# Altium schematic sheet S7CAS-PLEIADES-CARTE-FILLE_P02_ALIMENTATION.SchDoc
size Tabloid; DocumentNumber: 2; SheetNumber: 2; SheetTotal: 5; Size: 11x17; Sheet_Name: ALIMENTATION
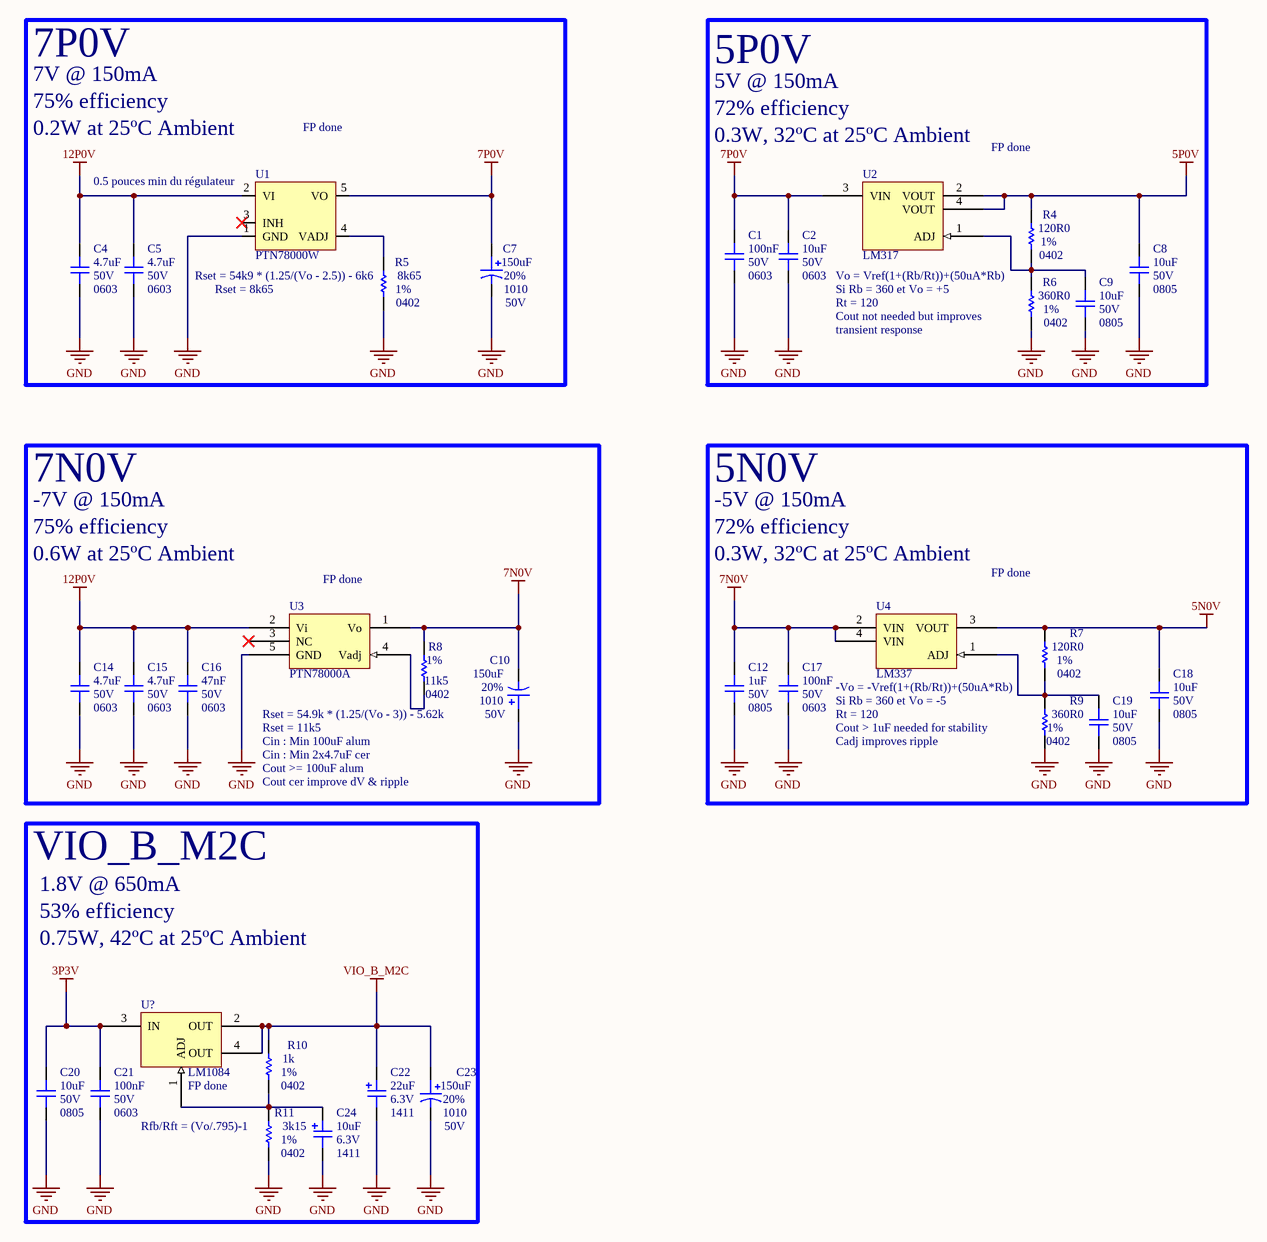
[diagram p0: S7CAS-PLEIADES-CARTE-FILLE_P02_ALIMENTATION.SchDoc]

## Parts
C1  value 100nF  Voltage: 50V  Package: 0603  [CAP_0603]  (hidden comment: CAP - 0603)
C2  value 10uF  Voltage: 50V  Package: 0603  [CAP_0603]  (hidden comment: CAP - 0603)
C4  value 4.7uF  Voltage: 50V  Package: 0603  [CAP_0603]  (hidden comment: CAP - 0603)
C5  value 4.7uF  Voltage: 50V  Package: 0603  [CAP_0603]  (hidden comment: CAP - 0603)
C7  value 150uF  Voltage: 50V  Package: 1010  Precision: 20%  [CAP_ALU_1010_vishay]  (hidden comment: MAL215099101E3)
C8  value 10uF  Voltage: 50V  Package: 0805  [CAP_0805]  (hidden comment: CAP - 0805)
C9  value 10uF  Voltage: 50V  Package: 0805  [CAP_0805]  (hidden comment: CAP - 0805)
C10  value 150uF  Voltage: 50V  Package: 1010  Precision: 20%  [CAP_ALU_1010_vishay]  (hidden comment: MAL215099101E3)
C12  value 1uF  Voltage: 50V  Package: 0805  [CAP_0805]  (hidden comment: CAP - 0805)
C14  value 4.7uF  Voltage: 50V  Package: 0603  [CAP_0603]  (hidden comment: CAP - 0603)
C15  value 4.7uF  Voltage: 50V  Package: 0603  [CAP_0603]  (hidden comment: CAP - 0603)
C16  value 47nF  Voltage: 50V  Package: 0603  [CAP_0603]  (hidden comment: CAP - 0603)
C17  value 100nF  Voltage: 50V  Package: 0603  [CAP_0603]  (hidden comment: CAP - 0603)
C18  value 10uF  Voltage: 50V  Package: 0805  [CAP_0805]  (hidden comment: CAP - 0805)
C19  value 10uF  Voltage: 50V  Package: 0805  [CAP_0805]  (hidden comment: CAP - 0805)
C20  value 10uF  Voltage: 50V  Package: 0805  [CAP_0805]  (hidden comment: CAP - 0805)
C21  value 100nF  Voltage: 50V  Package: 0603  [CAP_0603]  (hidden comment: CAP - 0603)
C22  value 22uF  Voltage: 6.3V  Package: 1411  [CAP_TAN_1411(B)]  (hidden comment: CAP - TANTALUM - CASE B)
C23  value 150uF  Voltage: 50V  Package: 1010  Precision: 20%  [CAP_ALU_1010_vishay]  (hidden comment: MAL215099101E3)
C24  value 10uF  Voltage: 6.3V  Package: 1411  [CAP_TAN_1411(B)]  (hidden comment: CAP - TANTALUM - CASE B)
R4  value 120R0  Package: 0402  Precision: 1%  [RES_0402]  (hidden comment: RES - 0402)
R5  value 8k65  Package: 0402  Precision: 1%  [RES_0402]  (hidden comment: RES - 0402)
R6  value 360R0  Package: 0402  Precision: 1%  [RES_0402]  (hidden comment: RES - 0402)
R7  value 120R0  Package: 0402  Precision: 1%  [RES_0402]  (hidden comment: RES - 0402)
R8  value 11k5  Package: 0402  Precision: 1%  [RES_0402]  (hidden comment: RES - 0402)
R9  value 360R0  Package: 0402  Precision: 1%  [RES_0402]  (hidden comment: RES - 0402)
R10  value 1k  Package: 0402  Precision: 1%  [RES_0402]  (hidden comment: RES - 0402)
R11  value 3k15  Package: 0402  Precision: 1%  [RES_0402]  (hidden comment: RES - 0402)
U1  PTN78000W  [PTN78000W]
U2  LM317  [LM317-DCY]
U3  PTN78000A  [PTN78000A]
U4  LM337  [LM337-DCY]
U?  LM1084  [LM1084-DPAK]

## Blocks framed on the sheet
7P0V: C4 C5 C7 R5 U1
5P0V: C1 C2 C8 C9 R4 R6 U2
7N0V: C10 C14-C16 R8 U3
5N0V: C12 C17-C19 R7 R9 U4
VIO_B_M2C: C20-C24 R10 R11 U?

## Nets
3P3V: C20.2 C21.2 U?.3(IN)
5N0V: C18.2 R7.2 U4.3(VOUT)
5P0V: C8.2 R4.2 U2.2(VOUT) U2.4(VOUT)
7N0V: C10.2 C12.2 C17.2 R8.1 U3.1(Vo) U4.2(VIN) U4.4(VIN)
7P0V: C1.2 C2.2 C7.1 U1.5(VO) U2.3(VIN)
12P0V: C4.2 C5.2 C14.2 C15.2 C16.2 U1.2(VI) U3.2(Vi)
GND: C1.1 C2.1 C4.1 C5.1 C7.2 C8.1 C9.1 C10.1 C12.1 C14.1 C15.1 C16.1 C17.1 C18.1 C19.1 C20.1 C21.1 C22.1 C23.2 C24.1 R5.1 R6.1 R9.1 R11.1 U1.1(GND) U3.5(GND)
VIO_B_M2C: C22.2 C23.1 R10.2 U?.2(OUT) U?.4(OUT)
NetC9_2: C9.2 R4.1 R6.2 U2.1(ADJ)
NetC19_2: C19.2 R7.1 R9.2 U4.1(ADJ)
NetC24_2: C24.2 R10.1 R11.2 U?.1(ADJ)
NetR5_2: R5.2 U1.4(VADJ)
NetR8_2: R8.2 U3.4(Vadj)

Not connected (* = marked no-connect by the designer): U1 3(INH)*; U3 3(NC)*

## Notes on the sheet
- 7V @ 150mA
- 75% efficiency
- 0.2W at 25ºC Ambient
- FP done
- 5V @ 150mA
- 72% efficiency
- (near U2) 0.3W, 32ºC at 25ºC Ambient
- (near U1) 0.5 pouces min du régulateur
- (near R5) Rset = 54k9 * (1.25/(Vo - 2.5)) - 6k6
- Vo = Vref(1+(Rb/Rt))+(50uA*Rb)
- (near U1) Rset = 8k65
- Si Rb = 360 et Vo = +5
- Rt = 120
- (near R6) Cout not needed but improves
- transient response
- -7V @ 150mA
- -5V @ 150mA
- 0.6W at 25ºC Ambient
- (near U3) FP done
- 0.3W, 32ºC at 25ºC Ambient
- Rset = 54.9k * (1.25/(Vo - 3)) - 5.62k
- Rset = 11k5
- Cin : Min 100uF alum
- -Vo = -Vref(1+(Rb/Rt))+(50uA*Rb)
- Si Rb = 360 et Vo = -5
- (near R9) Cout > 1uF needed for stability
- Cadj improves ripple
- Cin : Min 2x4.7uF cer
- Cout cer improve dV & ripple
- Cout >= 100uF alum
- 1.8V @ 650mA
- 53% efficiency
- 0.75W, 42ºC at 25ºC Ambient
- (near U?) FP done
- (near R11) Rfb/Rft = (Vo/.795)-1
- Sheet Name
- Project Title
- Global Project
- Size
- Group
- Revision
- Date
- Sheet
- of
- Filename
- Designers

## Library data of the parts
C1 C2 C4 C5 C14-C17 C21 = CAP - 0603: Precision: 10%; Current: *; CreatedBy: Jonathan Bouchard; Power: *
C7 C10 C23 = CAP_ALU_MAL215099101E3: CAP - ALU 100uF 20% 50V - 1010; Current: 490mA; Mfg: Vishay Dale; Mfg Part Number: MAL215099101E3; HelpURL: http://www.vishay.com/docs/28395/150crz.pdf; CreatedBy: Jonathan Bouchard; Temperature: -55°C to 125°C; Power: *; Supplier 1: Digikey; Supplier Part Number 1: 4399PHDKR-ND
C8 C9 C12 C18-C20 = CAP - 0805: Precision: 10%; Current: *; CreatedBy: Jonathan Bouchard; Power: *
C22 C24 = CAP_TANT_1411(B): CAP - TANTALUM - 1411; Precision: 10%; Current: *; CreatedBy: Jonathan Bouchard; Power: *
R4 R6-R11 = RES - 0402: Voltage: 50V; Power: 1/16W; Current: *; CreatedBy: Jonathan Bouchard
R5 = RES - 0402: RES - 0402 - 1/16W; Voltage: 50V; Current: *; CreatedBy: Jonathan Bouchard; Power: 1/16W
U1 = PTN78000H: XXX - 1.5-A, / WIDE-INPUT / ADJUSTABLE / SWITCHING / REGULATOR - Package; GRAMS Lib Spec: 2.7